# EAGLE schematic TH3122_to_ARDUINO (EAGLE 7.2.0)
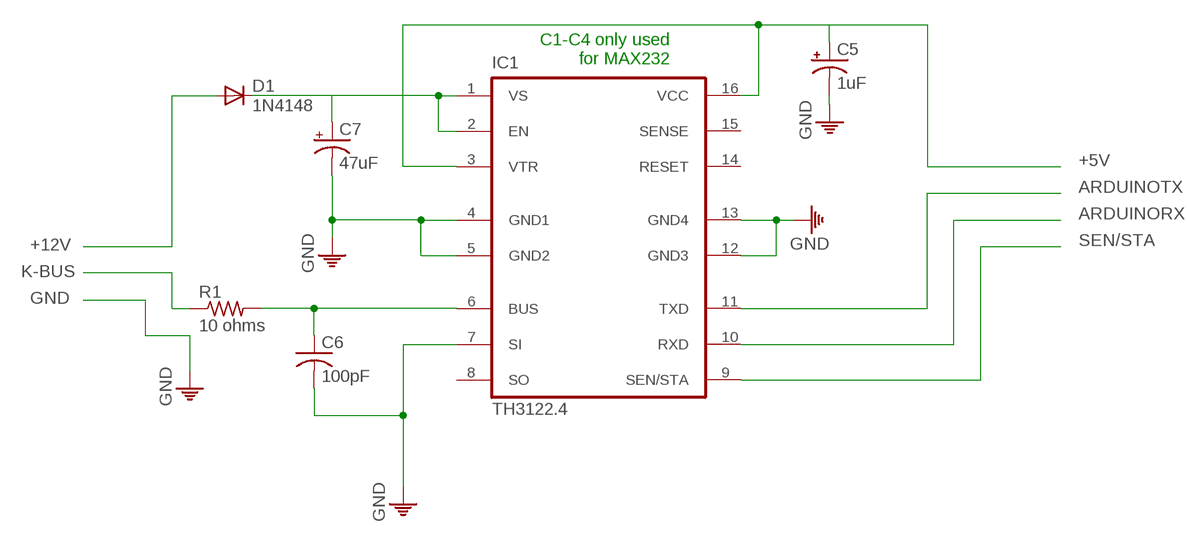
[diagram p0: schematic, sheet 1]

## Parts
C5  1uF  CPOL-USA  [PANASONIC_A]
C6  100pF  C-US025-030X050  [C025-030X050]
C7  47uF  CPOL-USA  [PANASONIC_A]
D1  1N4148  1N4148DO35-10  [DO35-10]
IC1  TH3122.4  [TH3122]
R1  10 ohms  R-US_0204/5  [0204/5]

## Nets
+5V: C5.+ IC1.3(VTR) IC1.16(VCC)
+12V: D1.A
ARDUINORX: IC1.10(RXD)
ARDUINOTX: IC1.11(TXD)
GND: C5.- C6.2 C7.- IC1.4(GND1) IC1.5(GND2) IC1.7(SI) IC1.12(GND3) IC1.13(GND4)
K-BUS: R1.1
N$3: C6.1 IC1.6(BUS) R1.2
N$21: C7.+ D1.C IC1.1(VS) IC1.2(EN)
SEN/STA: IC1.9(SEN/STA)
Unconnected: IC1.8(SO) IC1.14(RESET) IC1.15(SENSE)

## Notes on the sheet
- C1-C4 only used
  for MAX232

## Library data of the parts
C5 C7 = resistor:CPOL-US: POLARIZED CAPACITOR, American symbol
C6 = resistor:C-US: CAPACITOR, American symbol
D1 = diode:1N4148: DIODE high speed (Philips)
IC1 = BMW_K-Bus:TH3122: TH3122.4
R1 = resistor:R-US_: RESISTOR, American symbol